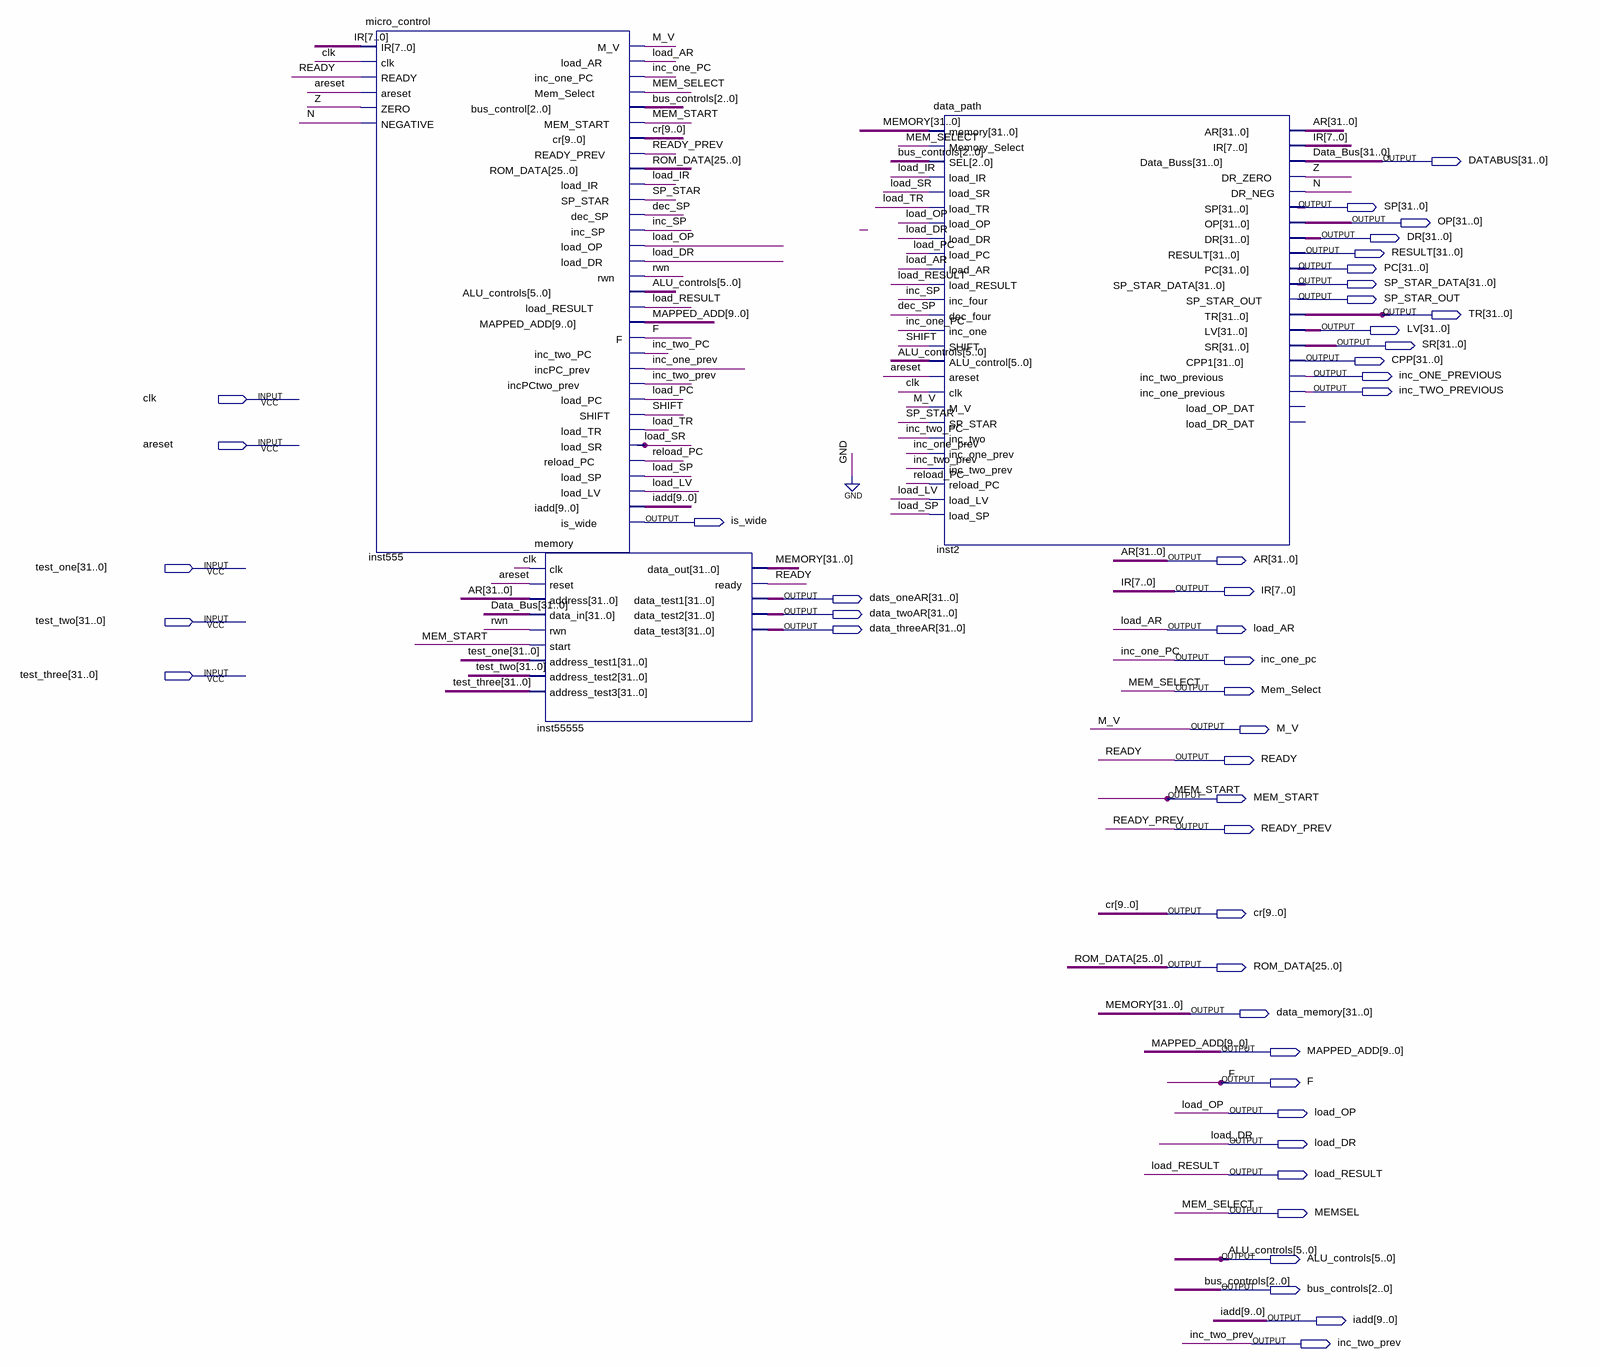
[diagram p0: schematic sheet]
// Quartus schematic CPU.bdf as structural Verilog: 3 symbols, 45 pins
module CPU (
  input  clk,
  input  areset,
  input  [31:0] test_one,
  input  [31:0] test_two,
  input  [31:0] test_three,
  output [31:0] DATABUS,
  output [31:0] SP,
  output [31:0] OP,
  output [31:0] DR,
  output [31:0] RESULT,
  output [31:0] PC,
  output [31:0] SP_STAR_DATA,
  output SP_STAR_OUT,
  output [31:0] TR,
  output [31:0] LV,
  output [31:0] SR,
  output [31:0] CPP,
  output inc_ONE_PREVIOUS,
  output inc_TWO_PREVIOUS,
  output is_wide,
  output [31:0] AR,
  output [7:0] IR,
  output [31:0] dats_oneAR,
  output [31:0] data_twoAR,
  output [31:0] data_threeAR,
  output load_AR,
  output inc_one_pc,
  output Mem_Select,
  output M_V,
  output READY,
  output MEM_START,
  output READY_PREV,
  output [9:0] cr,
  output [25:0] ROM_DATA,
  output [31:0] data_memory,
  output [9:0] MAPPED_ADD,
  output F,
  output load_OP,
  output load_DR,
  output load_RESULT,
  output MEMSEL,
  output [5:0] ALU_controls,
  output [2:0] bus_controls,
  output [9:0] iadd,
  output inc_two_prev
);

  wire dec_SP, inc_one_prev, inc_SP, inc_two_PC, load_IR, load_LV, load_PC, load_SP, load_SR, load_TR, N,
       reload_PC, rwn, SHIFT, SP_STAR, Z;

  micro_control inst555 (
    .IR(IR), .clk(clk), .READY(READY), .areset(areset), .ZERO(Z), .NEGATIVE(N), .M_V(M_V), .load_AR(load_AR),
    .inc_one_PC(inc_one_pc), .Mem_Select(Mem_Select), .bus_control(bus_controls), .MEM_START(MEM_START),
    .cr(cr), .READY_PREV(READY_PREV), .ROM_DATA(ROM_DATA), .load_IR(load_IR), .SP_STAR(SP_STAR),
    .dec_SP(dec_SP), .inc_SP(inc_SP), .load_OP(load_OP), .load_DR(load_DR), .rwn(rwn),
    .ALU_controls(ALU_controls), .load_RESULT(load_RESULT), .MAPPED_ADD(MAPPED_ADD), .F(F),
    .inc_two_PC(inc_two_PC), .incPC_prev(inc_one_prev), .incPCtwo_prev(inc_two_prev), .load_PC(load_PC),
    .SHIFT(SHIFT), .load_TR(load_TR), .load_SR(load_SR), .reload_PC(reload_PC), .load_SP(load_SP),
    .load_LV(load_LV), .iadd(iadd), .is_wide(is_wide));
  memory inst55555 (
    .clk(clk), .reset(areset), .address(AR), .data_in(DATABUS), .rwn(rwn), .start(MEM_START),
    .address_test1(test_one), .address_test2(test_two), .address_test3(test_three), .data_out(data_memory),
    .ready(READY), .data_test1(dats_oneAR), .data_test2(data_twoAR), .data_test3(data_threeAR));
  data_path inst2 (
    .memory(data_memory), .Memory_Select(Mem_Select), .SEL(bus_controls), .load_IR(load_IR),
    .load_SR(load_SR), .load_TR(load_TR), .load_OP(load_OP), .load_DR(load_DR), .load_PC(load_PC),
    .load_AR(load_AR), .load_RESULT(load_RESULT), .inc_four(inc_SP), .dec_four(dec_SP), .inc_one(inc_one_pc),
    .SHIFT(SHIFT), .ALU_control(ALU_controls), .areset(areset), .clk(clk), .M_V(M_V), .SP_STAR(SP_STAR),
    .inc_two(inc_two_PC), .inc_one_prev(inc_one_prev), .inc_two_prev(inc_two_prev), .reload_PC(reload_PC),
    .load_LV(load_LV), .load_SP(load_SP), .AR(AR), .IR(IR), .Data_Buss(DATABUS), .DR_ZERO(Z), .DR_NEG(N),
    .SP(SP), .OP(OP), .DR(DR), .RESULT(RESULT), .PC(PC), .SP_STAR_DATA(SP_STAR_DATA),
    .SP_STAR_OUT(SP_STAR_OUT), .TR(TR), .LV(LV), .SR(SR), .CPP1(CPP), .inc_two_previous(inc_ONE_PREVIOUS),
    .inc_one_previous(inc_TWO_PREVIOUS));  // open: load_OP_DAT, load_DR_DAT

  assign MEMSEL = Mem_Select;

  // Other names for the same wires on the sheet: Data_Bus[31:0] = DATABUS; MEMORY[31:0] = data_memory
endmodule
